# Altium project tclab_v1i1.PrjPcb (part 1 of 4)
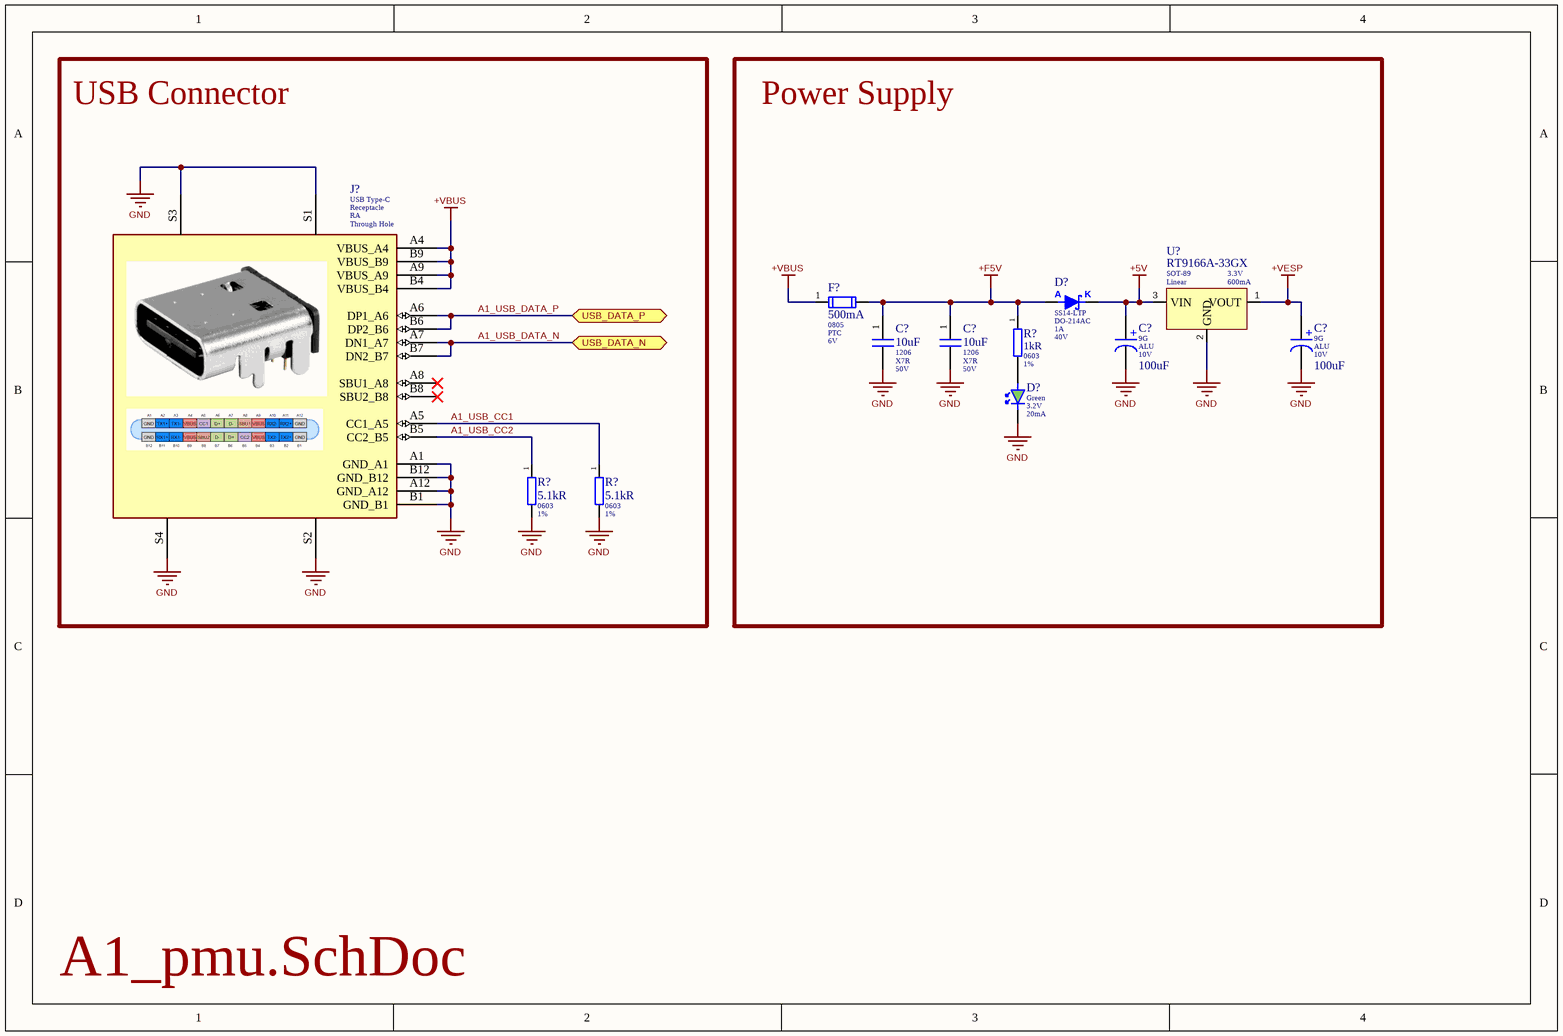
[diagram p0: A1_pmu.SchDoc]
6 sheets, 119 parts. Net scope: flat (ports and power ports of the same name join across sheets).
Sheets:
  A1_pmu.SchDoc
  A2_shield.SchDoc
  A3_plants.SchDoc
  A4_esp32.SchDoc
  A5_sub_interface.SchDoc
  A6_fan_indicator.SchDoc

## Sheet A1_pmu.SchDoc
size A4; SheetNumber: 1; SheetTotal: 6

### Parts
(Parts that share a designator on the sheet are numbered #1, #2 ... from top to bottom, then left to right.)
C?#1  Capacitance: 10uF  Case/Package: 1206  Dielectric: X7R  Voltage Rating (DC): 50V  [CAPC3216X18N]  (hidden comment: CAP-CER_10u_50V_10%_X7R_1206)
C?#2  Capacitance: 10uF  Case/Package: 1206  Dielectric: X7R  Voltage Rating (DC): 50V  [CAPC3216X18N]  (hidden comment: CAP-CER_10u_50V_10%_X7R_1206)
C?#3  _Case Size: 9G  _Type: ALU  Voltage Rating: 10V  Capacitance: 100uF  [CAPAE7866X56M]  (hidden comment: CAP-ALU_100uF_10V_20%_9G/SMD)
C?#4  _Case Size: 9G  _Type: ALU  Voltage Rating: 10V  Capacitance: 100uF  [CAPAE7866X56M]  (hidden comment: CAP-ALU_100uF_10V_20%_9G/SMD)
D?#1  MFG PN: SS14-LTP  Case/Package: DO-214AC  Average Rectified Current: 1A  Max Reverse Voltage (DC): 40V  [DIOM4327X30N]  (hidden comment: DIO-S_500mV_40V_1A_DO-214AC(SMA))
D?#2  Color: Green  Forward Voltage: 3.2V  Test Current: 20mA  [LEDC1608X08N_G]  (hidden comment: LED_green_3.2V_20mA_0603)
F?  Hold Current: 500mA  Case/Package: 0805  _Type: PTC  Voltage Rating: 6V  [FUSC2214X85N]  (hidden comment: FUSE-PTC_500mA_6V_0805_RST)
J?  _Type: USB Type-C  _Mating_type: Receptacle  _Orientation: RA  _Mount: Through Hole  [VALCON_CSP-USC16-TR]  (hidden comment: CON-USBC_receptacle_RA_TH)
R?#1  Resistance: 1kR  Case/Package: 0603  Tolerance: 1%  [RESC1608X06N]  (hidden comment: RES_1K_100mW_1%_0603)
R?#2  Resistance: 5.1kR  Case/Package: 0603  Tolerance: 1%  [RESC1608X06N]  (hidden comment: RES_5.1K_100mW_1%_0603)
R?#3  Resistance: 5.1kR  Case/Package: 0603  Tolerance: 1%  [RESC1608X06N]  (hidden comment: RES_5.1K_100mW_1%_0603)
U?#1  MFG PN: RT9166A-33GX  Case/Package: SOT-89  Type: Linear  Output Voltage: 3.3V  Output Current: 600mA  [SOT89-150P349X160-3N]  (hidden comment: REG-LIN_3-5.5Vin_3.3Vout_600mA_571mW_SOT-89)

### Blocks framed on the sheet
USB Connector: J? R?#2 R?#3
Power Supply: C?#1-C?#4 D?#1 D?#2 F? R?#1 U?#1

### Ports
USB_DATA_N (bidir), USB_DATA_P (bidir)

### Nets
+5V: C?#3.1(Positive) D?#1.2(K) U?#1.3(VIN)
+F5V: C?#1.1 C?#2.1 D?#1.1(A) F?.2 R?#1.1
+VBUS: F?.1 J?.A4(VBUS_A4) J?.A9(VBUS_A9) J?.B4(VBUS_B4) J?.B9(VBUS_B9)
+VESP: C?#4.1(Positive) U?#1.1(VOUT)
GND: C?#1.2 C?#2.2 C?#3.2(Negative) C?#4.2(Negative) D?#2.2(K) J?.A1(GND_A1) J?.A12(GND_A12) J?.B1(GND_B1) J?.B12(GND_B12) J?.S1(SHELL_GND_S1) J?.S2(SHELL_GND_S2) J?.S3(SHELL_GND_S3) J?.S4(SHELL_GND_S4) R?#2.2 R?#3.2 U?#1.2(GND)
A1_USB_CC1: J?.A5(CC1_A5) R?#3.1
A1_USB_CC2: J?.B5(CC2_B5) R?#2.1
A1_USB_DATA_N: J?.A7(DN1_A7) J?.B7(DN2_B7) ; port USB_DATA_N
A1_USB_DATA_P: J?.A6(DP1_A6) J?.B6(DP2_B6) ; port USB_DATA_P
NetD?#2_1: D?#2.1(A) R?#1.2

Not connected (* = marked no-connect by the designer): J? A8(SBU1_A8)* B8(SBU2_B8)*

### Notes on the sheet
- (in symbol Kemet_EDK107M010A9GAA) +

### Library data of the parts
C?#1 C?#2 = Samsung_CL31B106KBHNNNE: Tolerance: 10%; _Checked_PCB: HoP; Supplier 1: Mouser; MFG: Samsung; MFG PN: CL31B106KBHNNNE; RoHS: Yes; Category: Ceramic Capacitors; Stock 1: 1053279; Pricing 1: 1=0.33, 10=0.232, 50=0.232, 100=0.14, 1000=0.089, 10000=0.071 (USD); Mount: Surface Mount; Case Code (Metric): 3216; Case Code (Imperial): 1206; Min Operating Temperature: -55°C; Max Operating Temperature: 125°C; Packaging: Cut Tape; Series: CL; Lead Free: Lead Free; RoHS Compliant: Yes; ComponentLink1URL: http://www.samsungsem.com/kr/support/product-search/mlcc/CL31B106KBHNNNE.jsp?src-supplier=Digi-Key; ComponentLink1Description: http://www.samsungsem.com/kr/support/product-search/mlcc/CL31B106KBHNNNE.jsp?src-supplier=Digi-Key; Supplier Part Number 1: 187-CL31B106KBHNNNE; _Checked_SCH: HoP; _Creator: HoP; _SYM_REF: CAP-CER_10u_50V_10%_X7R_1206; Voltage Rating: 50V
C?#3 C?#4 = Kemet_EDK107M010A9GAA: MFG: KEMET; Tolerance: 20%; Ripple Current: 70mA; Life (Hours): 2000Hour; _Checked_PCB: HoP; Supplier 1: Mouser; MFG PN: EDK107M010A9GAA; RoHS: Yes; Category: Aluminum Electrolytic Capacitors; Stock 1: 3002; Pricing 1: 1=0.36, 10=0.248, 50=0.174, 100=0.149, 1000=0.094, 10000=0.089 (USD); Mount: Surface Mount; Case/Package: Radial; Min Operating Temperature: -40°C; Max Operating Temperature: 85°C; Ripple Current (AC): 70mA; Packaging: Cut Tape; Voltage Rating (DC): 10V; Series: EDK; Diameter: 6.3mm; Height: 5.4mm; Radiation Hardening: No; Reach SVHC Compliant: No; RoHS Compliant: Yes; ComponentLink1URL: https://datasheet.ciiva.com/8032/1680956-8032470.pdf?src-supplier=Element14; ComponentLink1Description: https://datasheet.ciiva.com/8032/1680956-8032470.pdf?src-supplier=Element14; Supplier Part Number 1: 80-EDK107M010A9GAA; _Checked_SCH: HoP; _Creator: HoP; _SYM_REF: CAP-ALU_100uF_10V_20%_9G/SMD
D?#1 = MCC_SS14-LTP: MFG: MCC; Forward Voltage: 500mV; Peak Non-Repetitive Surge Current: 30A; _Checked_PCB: HoP; Supplier 1: Mouser; RoHS: Yes; Category: Uncategorized; Stock 1: 415; Pricing 1: 1=0.26, 10=0.209, 50=0.209, 100=0.111, 1000=0.045, 10000=0.037 (USD); Mount: Surface Mount; Number of Pins: 2; Min Operating Temperature: -55°C; Max Operating Temperature: 150°C; Packaging: Tape and Reel; Series: -; RoHS Compliant: Yes; Lead Free: Lead Free; ComponentLink1URL: http://components.arrow.com/part/dataview/45990919S110376N2022?src-supplier=Arrow+Electronics; ComponentLink1Description: http://components.arrow.com/part/dataview/45990919S110376N2022?src-supplier=Arrow+Electronics; ComponentLink2URL: http://www.mccsemi.com/up_pdf/SS12-L-SS110-L(DO-214AC)-E.pdf?src-supplier=Digi-Key; ComponentLink2Description: http://www.mccsemi.com/up_pdf/SS12-L-SS110-L(DO-214AC)-E.pdf?src-supplier=Digi-Key; ComponentLink3URL: https://www.mccsemi.com/pdf/Products/SS12-L-SS110-L(DO-214AC)-E.pdf?src-supplier=Digi-Key; ComponentLink3Description: https://www.mccsemi.com/pdf/Products/SS12-L-SS110-L(DO-214AC)-E.pdf?src-supplier=Digi-Key; Supplier Part Number 1: 833-SS14-LTP; _Checked_SCH: HoP; _Creator: HoP; _SYM_REF: DIO-S_500mV_40V_1A_DO-214AC(SMA)
D?#2 = Wurth_150060GS75000: MFG: Wurth Elektronik; Dominant Wavelength: 525nm; Forward Current: 100mA; Lens Style: Clear, Rectangular; Luminous Intensity: 430mcd; Max Junction Temperature (Tj): 95°C; Max Reverse Voltage (DC): 5V; Output Current: 10µA; Peak Wavelength: 515nm; Power Dissipation: 105mW; Viewing Angle: 140°; _Checked_PCB: N.A; _Checked_SCH: HoP; Supplier: DigiKey; Supplier Part Number: 732-4971-1-ND; MFG PN: 150060GS75000; RoHS: Compliant; Category: LEDs; Stock: 374535; Pricing: 1=0.15, 50=0.142, 100=0.1239 (USD); Case/Package: 0603; Case Code (Imperial): 0603; Case Code (Metric): 1608; Height: 700µm; Lead Free: Lead Free; Length: 1.6mm; Max Operating Temperature: 85°C; Min Operating Temperature: -40°C; Mounting Technology: Surface Mount; Packaging: Tape and Reel; REACH SVHC: Unknown; Reverse Voltage: 5V; Wavelength: 525nm; Width: 800µm; ComponentLink1URL: https://datasheet.octopart.com:443/150060GS75000-W%C3%BCrth-Elektronik-datasheet-140603450.pdf?src-supplier=Wurth+Elektronik; ComponentLink1Description: https://datasheet.octopart.com:443/150060GS75000-W%C3%BCrth-Elektronik-datasheet-140603450.pdf?src-supplier=Wurth+Elektronik; ComponentLink2URL: https://datasheet.octopart.com:443/150060GS75000-W%C3%BCrth-Elektronik-datasheet-15976794.pdf?src-supplier=Upverter; ComponentLink2Description: https://datasheet.octopart.com:443/150060GS75000-W%C3%BCrth-Elektronik-datasheet-15976794.pdf?src-supplier=Upverter; ComponentLink3URL: https://datasheet.octopart.com:443/150060GS75000-W%C3%BCrth-Elektronik-datasheet-41196437.pdf?src-supplier=Future+Electronics; ComponentLink3Description: https://datasheet.octopart.com:443/150060GS75000-W%C3%BCrth-Elektronik-datasheet-41196437.pdf?src-supplier=Future+Electronics; _Creator: HoP; _SYM_REF: LED_green_3.2V_20mA_0603
F? = BOURNS_MF-PSMF050X-2: MFG: Bourns; Max Current Rating: 40A; Resistance: 900mR; Power Dissipation: 500mW; Trip Current: 1A; Time to Trip: 100ms; Approvals: UL; _Checked_PCB: HoP; Supplier 1: Mouser; MFG PN: MF-PSMF050X-2; RoHS: Yes; Category: PTC Resettable Fuses; Stock 1: 26346; Pricing 1: 1=0.33, 10=0.27, 50=0.27, 100=0.204, 1000=0.172, 10000=0.172 (USD); Mount: Surface Mount,PCB; Number of Pins: 2; Case Code (Metric): 2012; Case Code (Imperial): 0805; Terminal Material: Gold; Min Operating Temperature: -40°C; Max Operating Temperature: 85°C; Packaging: Tape and Reel; Operating Supply Voltage: 6V; Package Quantity: 3000; Current Rating: 40A; Termination: SMD/SMT; Max Power Dissipation: 500mW; Voltage Rating (DC): 6V; Series: MF-PSMF; Length: 2.3mm; Width: 1.5mm; Height: 0.85mm; Radiation Hardening: No; Reach SVHC Compliant: No; RoHS Compliant: Yes; ComponentLink1URL: https://datasheet.ciiva.com/3019/mfpsmf-3019799.pdf?src-supplier=Avnet; ComponentLink1Description: https://datasheet.ciiva.com/3019/mfpsmf-3019799.pdf?src-supplier=Avnet; ComponentLink2URL: https://datasheet.ciiva.com/326/mfpsmf-326489.pdf?src-supplier=Digi-Key; ComponentLink2Description: https://datasheet.ciiva.com/326/mfpsmf-326489.pdf?src-supplier=Digi-Key; ComponentLink3URL: https://datasheet.ciiva.com/326/mfpsmf-326490.pdf?src-supplier=Digi-Key; ComponentLink3Description: https://datasheet.ciiva.com/326/mfpsmf-326490.pdf?src-supplier=Digi-Key; ComponentLink4URL: https://datasheet.ciiva.com/326/mfpsmf-326488.pdf?src-supplier=Digi-Key; ComponentLink4Description: https://datasheet.ciiva.com/326/mfpsmf-326488.pdf?src-supplier=Digi-Key; ComponentLink5URL: https://datasheet.ciiva.com/32430/mf-psmf-series-eng-tds-32430651.pdf?src-supplier=Distrelec; ComponentLink5Description: https://datasheet.ciiva.com/32430/mf-psmf-series-eng-tds-32430651.pdf?src-supplier=Distrelec; ComponentLink6URL: https://datasheet.ciiva.com/1274/1442129-1274589.pdf?src-supplier=Element14; ComponentLink6Description: https://datasheet.ciiva.com/1274/1442129-1274589.pdf?src-supplier=Element14; ComponentLink7URL: https://datasheet.ciiva.com/22712/1442129-22712191.pdf?src-supplier=Element14; ComponentLink7Description: https://datasheet.ciiva.com/22712/1442129-22712191.pdf?src-supplier=Element14; ComponentLink8URL: https://datasheet.ciiva.com/22657/1442129-22657847.pdf?src-supplier=Element14; ComponentLink8Description: https://datasheet.ciiva.com/22657/1442129-22657847.pdf?src-supplier=Element14; ComponentLink9URL: https://datasheet.ciiva.com/4501/mfpsmf-69505-4501179.pdf?src-supplier=Mouser; ComponentLink9Description: https://datasheet.ciiva.com/4501/mfpsmf-69505-4501179.pdf?src-supplier=Mouser; Supplier Part Number 1: 652-MF-PSMF050X-2; _Checked_SCH: HoP; _Creator: HoP; _SYM_REF: FUSE-PTC_500mA_6V_0805_RST
J? = Valcon_CSP-USC16-TR: MFG: Valcon; _Checked_PCB: HoP; Package: None; Price: None; Value: *; Purchase-URL: https://pricing.snapeda.com/search/part/CSP-USC16-TR/?ref=eda; SnapEDA_Link: https://www.snapeda.com/parts/CSP-USC16-TR/Valcon/view-part/?ref=snap; Check_prices: https://www.snapeda.com/parts/CSP-USC16-TR/Valcon/view-part/?ref=eda; Availability: In Stock; _Checked_SCH: HoP; _Creator: HoP; MFG PN: CSP-USC16-TR; _SYM_REF: CON-USBC_receptacle_RA_TH
R?#1 = Yageo_RC0603FR-071KL: MFG: Yageo; Temperature Coefficient: 100ppm/°C; Power Rating: 100mW; Voltage Rating: 50V; _Checked_PCB: HoP; _Value: 1000; Supplier 1: Mouser; MFG PN: RC0603FR-071KL; RoHS: Yes; Category: Chip SMD Resistors; Stock 1: 9806849; Pricing 1: 1=0.1, 10=0.019, 50=0.019, 100=0.007, 1000=0.004, 10000=0.002 (USD); Contact Plating: Tin,Matte; Case Code (Imperial): 0603; Case Code (Metric): 1608; Size Code: 0603; Min Operating Temperature: -55°C; Max Operating Temperature: 155°C; Resistor Type: Thick Film; Packaging: Tape and Reel; Termination: SMD/SMT; Features: Moisture Resistant; Series: RC; Max Power Dissipation: 100mW; Number of Terminations: 2; Technology: THICK FILM; Resistance Tolerance: 1%; Construction: Rectangular; Length: 1.6mm; Height: 0.45mm; Depth: 0.8mm; Reach SVHC Compliant: No; Lead Free: Lead Free; Military Standard: Not; RoHS Compliant: Yes; Supplier Part Number 1: 603-RC0603FR-071KL; _Checked_SCH: HoP; _Creator: HoP; _SYM_REF: RES_1K_100mW_1%_0603
R?#2 R?#3 = Yageo_RC0603FR-075K1L: MFG: Yageo; Power Rating: 100mW; Temperature Coefficient: 100ppm/°C; Voltage Rating: 50V; _Checked_PCB: HoP; _Value: 5100; Supplier 1: Mouser; MFG PN: RC0603FR-075K1L; RoHS: Yes; Category: Chip SMD Resistors; Stock 1: 136224; Pricing 1: 1=0.1, 10=0.016, 50=0.016, 100=0.008, 1000=0.004, 10000=0.002 (USD); Number of Pins: 2; Case Code (Imperial): 0603; Case Code (Metric): 1608; Size Code: 0603; Min Operating Temperature: -55°C; Max Operating Temperature: 155°C; Series: RC; Packaging: Tape and Reel; Package Quantity: 1; Termination: SMD/SMT; Resistor Type: Thick Film; Number of Terminations: 2; Max Power Dissipation: 100mW; Voltage Rating (DC): 50V; Features: Moisture Resistant; Resistance Tolerance: 1%; Construction: Rectangular; Length: 0.063inch; Width: 0.031inch; Height: 0.022inch; Depth: 0.8mm; RoHS Compliant: Yes; Reach SVHC Compliant: No; Military Standard: Not; Lead Free: Lead Free; ComponentLink1URL: https://datasheet.ciiva.com/46395/443971-46395016.pdf?src-supplier=Element14; ComponentLink1Description: https://datasheet.ciiva.com/46395/443971-46395016.pdf?src-supplier=Element14; ComponentLink2URL: https://datasheet.ciiva.com/2454/pyu-r-int-thick-7-2454046.pdf?src-supplier=Digi-Key; ComponentLink2Description: https://datasheet.ciiva.com/2454/pyu-r-int-thick-7-2454046.pdf?src-supplier=Digi-Key; ComponentLink3URL: https://datasheet.ciiva.com/2454/pyu-r-int-thick-7-2454047.pdf?src-supplier=Digi-Key; ComponentLink3Description: https://datasheet.ciiva.com/2454/pyu-r-int-thick-7-2454047.pdf?src-supplier=Digi-Key; ComponentLink4URL: https://datasheet.ciiva.com/2454/pyu-r-int-thick-7-2454045.pdf?src-supplier=Digi-Key; ComponentLink4Description: https://datasheet.ciiva.com/2454/pyu-r-int-thick-7-2454045.pdf?src-supplier=Digi-Key; ComponentLink5URL: https://datasheet.ciiva.com/15189/getdatasheetpartid-326732-15189786.pdf?src-supplier=Verical; ComponentLink5Description: https://datasheet.ciiva.com/15189/getdatasheetpartid-326732-15189786.pdf?src-supplier=Verical; Supplier Part Number 1: 603-RC0603FR-075K1L; _Checked_SCH: HoP; _Creator: HoP; _SYM_REF: RES_5.1K_100mW_1%_0603
U?#1 = Richtek_RT9166A-33GX: _Checked_PCB: N.A; _Checked_SCH: HoP; Max Supply Voltage: 5.5V; _Creator: HoP; _Package: SOT-89; _SYM_REF: REG-LIN_3-5.5Vin_3.3Vout_600mA_571mW_SOT-89; MFG: Richtek

## Sheet A2_shield.SchDoc
size A4; SheetNumber: 2; SheetTotal: 6
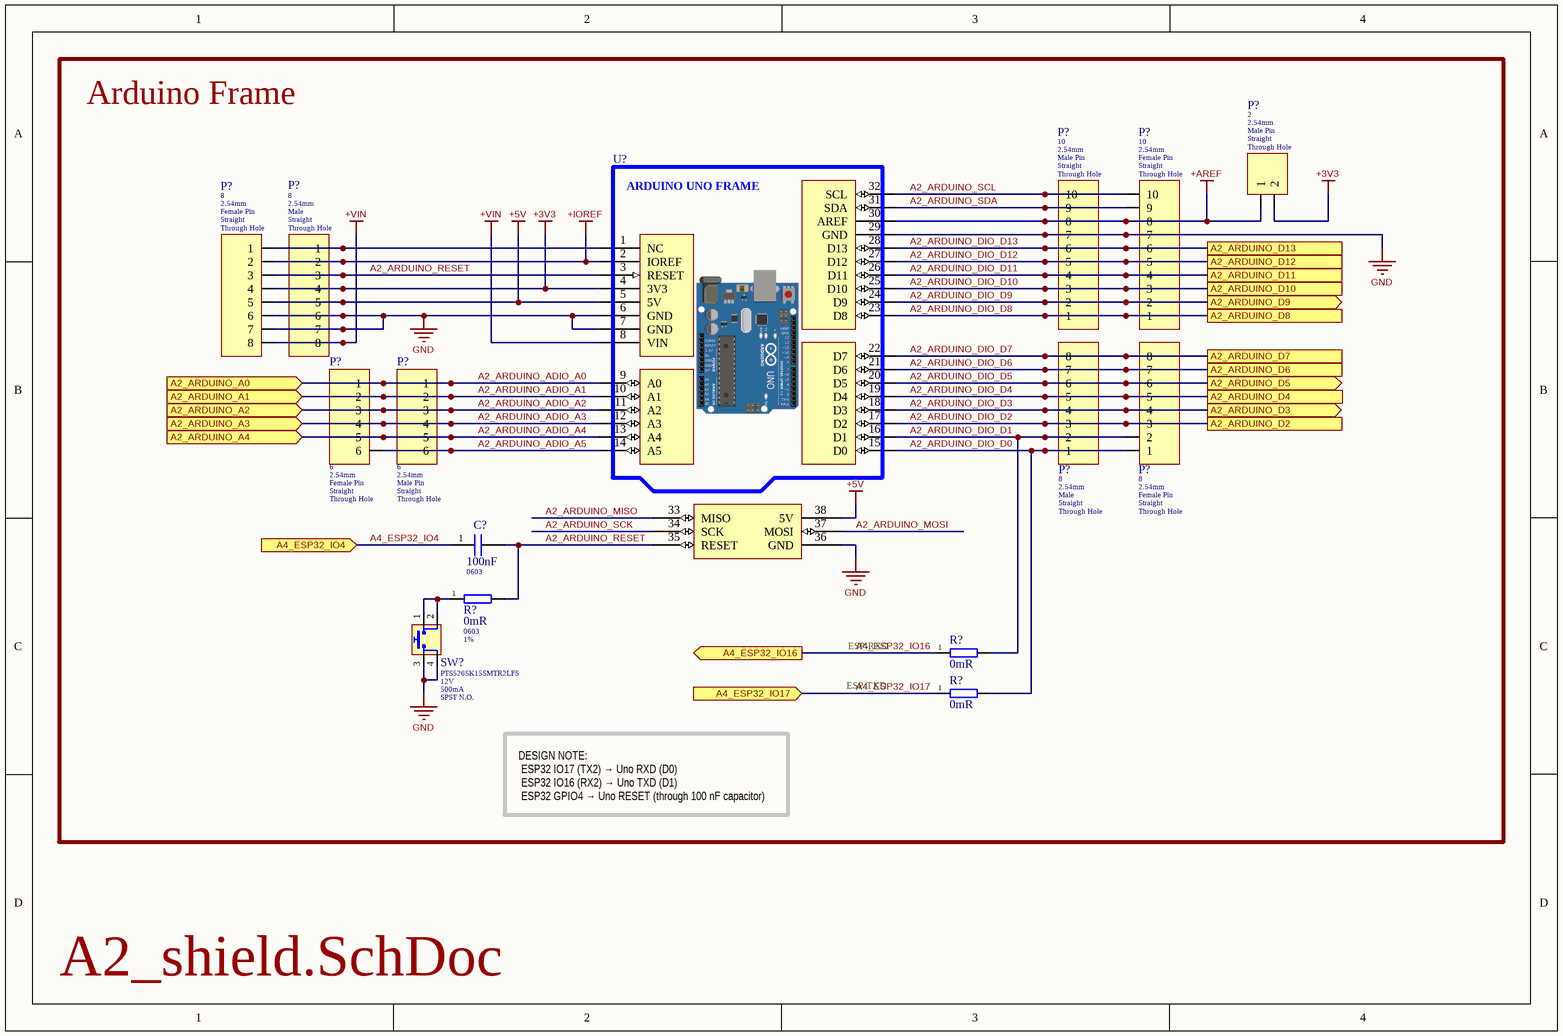
[diagram p1: A2_shield.SchDoc]

### Parts
(Parts that share a designator on the sheet are numbered #1, #2 ... from top to bottom, then left to right.)
C?#5  Capacitance: 100nF  Case/Package: 0603  [CAPC1608X09N]  (hidden comment: CAP-CER_100n_50V_20%_X7R_0603)
P?#1  Number of Contacts: 2  Pitch: 2.54mm  Contact Type: Male Pin  Orientation: Straight  Mounting Technology: Through Hole  [HARWIN_M20-9730246]  (hidden comment: CON-BS_male_2X1_254_ST_TH)
P?#2  Number of Contacts: 8  Pitch: 2.54mm  Contact Gender: Female Pin  Orientation: Straight  Mounting Technology: Through Hole  [HARWIN_M20-7820842]  (hidden comment: CON-BS_female_8X1_254_ST_TH)
P?#3  Number of Contacts: 8  Pitch: 2.54mm  Contact Gender: Male  Orientation: Straight  Mounting Technology: Through Hole  [HARWIN_M20-9730845]  (hidden comment: CON-BS_male_8X1_254_ST_TH)
P?#4  Number of Contacts: 10  Pitch: 2.54mm  Connector Type: Male Pin  Orientation: Straight  Mounting Technology: Through Hole  [HARWIN_M20-9731045]  (hidden comment: CON-BS_male_10X1_254_ST_TH)
P?#5  Number of Contacts: 10  Pitch: 2.54mm  Contact Gender: Female Pin  Orientation: Straight  Mounting Technology: Through Hole  [HARWIN_M20-7821046]  (hidden comment: CON-BS_female_10X1_254_ST_TH)
P?#6  Number of Contacts: 6  Pitch: 2.54mm  Contact Gender: Female Pin  Orientation: Straight  Mounting Technology: Through Hole  [HARWIN_M20-7820646]  (hidden comment: CON-BS_female_6X1_254_ST_TH)
P?#7  Number of Contacts: 6  Pitch: 2.54mm  Connector Type: Male Pin  Orientation: Straight  Mounting Technology: Through Hole  [HARWIN_M20-9730645]  (hidden comment: CON-BS_male_6X1_254_ST_TH)
P?#8  Number of Contacts: 8  Pitch: 2.54mm  Contact Gender: Male  Orientation: Straight  Mounting Technology: Through Hole  [HARWIN_M20-9730845]  (hidden comment: CON-BS_male_8X1_254_ST_TH)
P?#9  Number of Contacts: 8  Pitch: 2.54mm  Contact Gender: Female Pin  Orientation: Straight  Mounting Technology: Through Hole  [HARWIN_M20-7820842]  (hidden comment: CON-BS_female_8X1_254_ST_TH)
R?#4  Resistance: 0mR  Case/Package: 0603  Tolerance: 1%  [RESC1608X06N]  (hidden comment: RES_0R_100mW_1%_0603)
R?#5  Resistance: 0mR  [RESC1608X06N]  (hidden comment: RES_0R_100mW_1%_0603)
R?#6  Resistance: 0mR  [RESC1608X06N]  (hidden comment: RES_0R_100mW_1%_0603)
SW?#1  MFG PN: PTS526SK15SMTR2LFS  _Maximum Voltage: 12V  _Maximum Current: 500mA  _Function: SPST N.O.  [CK_PTS526SK15SMTR2LFS]  (hidden comment: SW_Tactile_1_SPST-N.O._12_500m_SMD)
U?#2  ARDUINO_UNO-FRAME-01  [ARDUINO_UNO_FRAME]  (value not drawn)  (no BOM)

### Ports
A2_ARDUINO_A0 (in), A2_ARDUINO_A1 (in), A2_ARDUINO_A2 (in), A2_ARDUINO_A3 (in), A2_ARDUINO_A4 (in), A2_ARDUINO_D2, A2_ARDUINO_D3 (out), A2_ARDUINO_D4, A2_ARDUINO_D5 (out), A2_ARDUINO_D6, A2_ARDUINO_D7, A2_ARDUINO_D8, A2_ARDUINO_D9 (out), A2_ARDUINO_D10, A2_ARDUINO_D11, A2_ARDUINO_D12, A2_ARDUINO_D13, A4_ESP32_IO4 (in), A4_ESP32_IO16 (out), A4_ESP32_IO17 (in)

### Nets
+3V3: P?#1.2 P?#2.4 P?#3.4 U?#2.4(3V3)
+5V: P?#2.5 P?#3.5 U?#2.5(5V) U?#2.38(5V)
+AREF: P?#1.1 P?#4.8 P?#5.8 U?#2.30(AREF)
+IOREF: P?#2.2 P?#3.2 U?#2.2(IOREF)
+VIN: P?#2.8 P?#3.8 U?#2.8(VIN)
GND: P?#2.6 P?#2.7 P?#3.6 P?#3.7 P?#4.7 P?#5.7 SW?#1.3 SW?#1.4 U?#2.6(GND) U?#2.7(GND) U?#2.29(GND) U?#2.36(GND)
A2_ARDUINO_ADIO_A0: P?#6.1 P?#7.1 U?#2.9(A0) ; port A2_ARDUINO_A0
A2_ARDUINO_ADIO_A1: P?#6.2 P?#7.2 U?#2.10(A1) ; port A2_ARDUINO_A1
A2_ARDUINO_ADIO_A2: P?#6.3 P?#7.3 U?#2.11(A2) ; port A2_ARDUINO_A2
A2_ARDUINO_ADIO_A3: P?#6.4 P?#7.4 U?#2.12(A3) ; port A2_ARDUINO_A3
A2_ARDUINO_ADIO_A4: P?#6.5 P?#7.5 U?#2.13(A4) ; port A2_ARDUINO_A4
A2_ARDUINO_ADIO_A5: P?#6.6 P?#7.6 U?#2.14(A5)
A2_ARDUINO_DIO_D0: P?#8.1 P?#9.1 R?#6.2 U?#2.15(D0)
A2_ARDUINO_DIO_D1: P?#8.2 P?#9.2 R?#5.2 U?#2.16(D1)
A2_ARDUINO_DIO_D2: P?#8.3 P?#9.3 U?#2.17(D2) ; port A2_ARDUINO_D2
A2_ARDUINO_DIO_D3: P?#8.4 P?#9.4 U?#2.18(D3) ; port A2_ARDUINO_D3
A2_ARDUINO_DIO_D4: P?#8.5 P?#9.5 U?#2.19(D4) ; port A2_ARDUINO_D4
A2_ARDUINO_DIO_D5: P?#8.6 P?#9.6 U?#2.20(D5) ; port A2_ARDUINO_D5
A2_ARDUINO_DIO_D6: P?#8.7 P?#9.7 U?#2.21(D6) ; port A2_ARDUINO_D6
A2_ARDUINO_DIO_D7: P?#8.8 P?#9.8 U?#2.22(D7) ; port A2_ARDUINO_D7
A2_ARDUINO_DIO_D8: P?#4.1 P?#5.1 U?#2.23(D8) ; port A2_ARDUINO_D8
A2_ARDUINO_DIO_D9: P?#4.2 P?#5.2 U?#2.24(D9) ; port A2_ARDUINO_D9
A2_ARDUINO_DIO_D10: P?#4.3 P?#5.3 U?#2.25(D10) ; port A2_ARDUINO_D10
A2_ARDUINO_DIO_D11: P?#4.4 P?#5.4 U?#2.26(D11) ; port A2_ARDUINO_D11
A2_ARDUINO_DIO_D12: P?#4.5 P?#5.5 U?#2.27(D12) ; port A2_ARDUINO_D12
A2_ARDUINO_DIO_D13: P?#4.6 P?#5.6 U?#2.28(D13) ; port A2_ARDUINO_D13
A2_ARDUINO_MISO: U?#2.33(MISO)
A2_ARDUINO_MOSI: U?#2.37(MOSI)
A2_ARDUINO_RESET: C?#5.2 P?#2.3 P?#3.3 R?#4.2 U?#2.3(RESET) U?#2.35(RESET)
A2_ARDUINO_SCK: U?#2.34(SCK)
A2_ARDUINO_SCL: P?#4.10 P?#5.10 U?#2.32(SCL)
A2_ARDUINO_SDA: P?#4.9 P?#5.9 U?#2.31(SDA)
A4_ESP32_IO4: C?#5.1 ; port A4_ESP32_IO4
A4_ESP32_IO16: R?#5.1 ; port A4_ESP32_IO16
A4_ESP32_IO17: R?#6.1 ; port A4_ESP32_IO17
NetP?#2_1: P?#2.1 P?#3.1 U?#2.1(NC)
NetR?#4_1: R?#4.1 SW?#1.1 SW?#1.2

### Notes on the sheet
- Arduino Frame
- ESP-RXD
- ESP-TXD
- DESIGN NOTE:
  ESP32 IO17 (TX2) → Uno RXD (D0)
  ESP32 IO16 (RX2) → Uno TXD (D1)
  ESP32 GPIO4 → Uno RESET (through 100 nF capacitor)
- (in symbol Arduino_Uno-Frame-01) ARDUINO UNO FRAME

### Library data of the parts
C?#5 = Kemet_C0603C104M5RAC: MFG: KEMET; Dielectric Material: Ceramic; Tolerance: 20%; _Checked_PCB: HoP; Dielectric: X7R; Voltage Rating (DC): 50V; Supplier 1: Mouser; MFG PN: C0603C104M5RAC; RoHS: Yes; Category: Ceramic Capacitors; Stock 1: 461921; Pricing 1: 1=0.1, 10=0.033, 50=0.033, 100=0.015, 1000=0.009, 10000=0.006 (USD); Mount: Surface Mount; Case Code (Imperial): 0603; Case Code (Metric): 1608; Min Operating Temperature: -55°C; Max Operating Temperature: 125°C; Packaging: Tape and Reel; Package Quantity: 4000; Termination: SMD/SMT; Series: C0603C; Construction: Flat; Length: 1.6mm; Width: 0.8mm; RoHS Compliant: Yes; ComponentLink1URL: http://www.mouser.com/ds/2/212/KEM_C1002_X7R_SMD-1102033.pdf?src-supplier=Mouser; ComponentLink1Description: http://www.mouser.com/ds/2/212/KEM_C1002_X7R_SMD-1102033.pdf?src-supplier=Mouser; Supplier Part Number 1: 80-C0603C104M5RAC; _Checked_SCH: HoP; _Creator: HoP; _SYM_REF: CAP-CER_100n_50V_20%_X7R_0603
P?#1 = Harwin_M20-9730246: MFG: Harwin; Current Rating: 3A; Voltage Rating: 750V; Contact Resistance: 30mR; Mated Stacking Heights: 16.54mm; _Checked_PCB: N.A; _Checked_SCH: HoP; Supplier: Mouser; Supplier Part Number: 855-M20-9730246; MFG PN: M20-9730246; RoHS: Yes; Category: Headers and Wire Housings; Stock: 7153; Pricing: 1=0.1, 10=0.08, 50=0.08, 100=0.066, 1000=0.053, 10000=0.043 (USD); Case/Package: SIL; Contact Material: Brass; Contact Plating: Tin; Color: Black; Housing Color: Black; Housing Material: Nylon; Contact Shape: Square; Contact Finish - Mating: TIN; Insulation Material: Nylon; Insulation Color: Black; Min Operating Temperature: -40°C; Max Operating Temperature: 105°C; Number of Rows: 1; Max Current Rating: 3A; Number of Positions: 2; Termination: Solder; Package Quantity: 1000; Packaging: Bulk; Series: M20; Fastening Type: Pull; Length: 5.08mm; Depth: 2.54mm; Contact Mating Length: 0.276inch; Radiation Hardening: No; RoHS Compliant: Yes; Flammability Rating: UL94 V-0; ComponentLink1URL: https://datasheet.ciiva.com/26899/getdatasheetpartid-501522-26899400.pdf?src-supplier=Verical; ComponentLink1Description: https://datasheet.ciiva.com/26899/getdatasheetpartid-501522-26899400.pdf?src-supplier=Verical; _Creator: HoP; _SYM_REF: CON-BS_male_2X1_254_ST_TH
P?#2 P?#9 = Harwin_M20-7820842: MFG: Harwin; Connector Type: Receptacle, Socket; Contact Resistance: 20mΩ; Current Rating: 3A; Dielectric Material: Polyamide; Gender: Female; Insulation Resistance: 1GΩ; _Checked_PCB: N.A; _Creator: HoP; Supplier: DigiKey; Supplier Part Number: 952-1823-ND; MFG PN: M20-7820842; RoHS: Compliant; Category: Card Edge Connectors; Stock: 504; Pricing: 1=1.27, 27=1.0063, 108=0.91231, 513=0.81725, 1026=0.77824, 5022=0.69577, 10017=0.66272 (USD); Case/Package: SIL; Color: Black; Contact Material: Bronze; Depth: 2.5mm; Housing Color: Black; Housing Material: Polyamide; Length: 20.72mm; Lifecycle Status: Production; Max Current Rating: 3A; Max Operating Temperature: 105°C; Min Operating Temperature: -40°C; Pins: 8; Number of Positions: 8; Number of Rows: 1; Radiation Hardening: No; REACH SVHC: Yes; Terminal Pitch: 2.54mm; Termination: Solder; Weight: 719.992839mg; ComponentLink1URL: https://datasheet.octopart.com:443/M20-7820842-Harwin-datasheet-176383844.pdf?src-supplier=Newark; ComponentLink1Description: https://datasheet.octopart.com:443/M20-7820842-Harwin-datasheet-176383844.pdf?src-supplier=Newark; ComponentLink2URL: https://datasheet.octopart.com:443/M20-7820842-Harwin-datasheet-99119574.pdf?src-supplier=Master+Electronics; ComponentLink2Description: https://datasheet.octopart.com:443/M20-7820842-Harwin-datasheet-99119574.pdf?src-supplier=Master+Electronics; ComponentLink3URL: http://sigma.octopart.com:80/15888290/rohs_statement/Harwin-M20-7820842.pdf?src-supplier=Compliance+Statements; ComponentLink3Description: http://sigma.octopart.com:80/15888290/rohs_statement/Harwin-M20-7820842.pdf?src-supplier=Compliance+Statements; _Checked_SCH: N.A; _SYM_REF: CON-BS_female_8X1_254_ST_TH; Contact Plating: Gold, Tin
P?#3 P?#8 = Harwin_M20-9730845: MFG: Harwin; Connector Type: Male Pin; Contact Resistance: 25mΩ; Current Rating: 3A; Dielectric Material: Polyamide; Insulation Resistance: 1GΩ; Voltage Rating: 750V; _Checked_PCB: N.A; _Checked_SCH: HoP; Supplier: DigiKey; Supplier Part Number: 952-1999-ND; MFG PN: M20-9730845; RoHS: Compliant; Category: Card Edge Connectors; Stock: 3821; Pricing: 1=0.43, 10=0.365, 100=0.3103, 500=0.2769, 1000=0.26367, 5000=0.23535, 10000=0.22412 (USD); Case/Package: SIL; Color: Black; Contact Material: Brass; Contact Mating Length: 7.0104mm; Contact Plating: Gold; Depth: 2.54mm; Gender: Male; Housing Color: Black; Housing Material: Nylon; Length: 20.32mm; Lifecycle Status: Production; Max Current Rating: 3A; Max Operating Temperature: 105°C; Min Operating Temperature: -40°C; Pins: 8; Number of Positions: 8; Number of Rows: 1; Radiation Hardening: No; REACH SVHC: Yes; Terminal Pitch: 2.54mm; Termination: Solder; ComponentLink1URL: https://datasheet.octopart.com:443/M20-9730845-Harwin-datasheet-179990786.pdf?src-supplier=IHS; ComponentLink1Description: https://datasheet.octopart.com:443/M20-9730845-Harwin-datasheet-179990786.pdf?src-supplier=IHS; _Creator: HoP; _SYM_REF: CON-BS_male_8X1_254_ST_TH
P?#4 = Harwin_M20-9731045: MFG: Harwin; Contact Resistance: 25mΩ; Current Rating: 3A; Dielectric Material: Polyamide; Gender: Male; Insulation Resistance: 1GΩ; Voltage Rating: 750V; _Checked_PCB: N.A; _Checked_SCH: HoP; Supplier: DigiKey; Supplier Part Number: 952-1841-ND; MFG PN: M20-9731045; RoHS: Compliant; Category: Card Edge Connectors; Stock: 614; Pricing: 1=0.54, 10=0.455, 100=0.387, 500=0.34534, 1000=0.32885, 5000=0.29354, 10000=0.27953 (USD); Case/Package: SIL; Color: Black; Contact Gender: Male; Contact Material: Brass; Contact Mating Length: 7.0104mm; Contact Plating: Gold; Depth: 2.54mm; Housing Color: Black; Housing Material: Nylon; Length: 25.4mm; Lifecycle Status: Production; Max Current Rating: 3A; Max Operating Temperature: 105°C; Min Operating Temperature: -40°C; Pins: 10; Number of Positions: 10; Number of Rows: 1; Radiation Hardening: No; REACH SVHC: Yes; Terminal Pitch: 2.54mm; Termination: Solder; ComponentLink1URL: https://datasheet.octopart.com:443/M20-9731045-Harwin-datasheet-179990786.pdf?src-supplier=IHS; ComponentLink1Description: https://datasheet.octopart.com:443/M20-9731045-Harwin-datasheet-179990786.pdf?src-supplier=IHS; _Creator: HoP; _SYM_REF: CON-BS_male_10X1_254_ST_TH
P?#5 = Harwin_M20-7821046: MFG: Harwin; Connector Type: Receptacle, Socket; Contact Resistance: 20mΩ; Current Rating: 3A; Dielectric Material: Polyamide; Gender: Female; Hole Diameter: 800µm; Insulation Resistance: 1GΩ; Operating Force: 4.8928N; _Checked_PCB: N.A; _Checked_SCH: HoP; Supplier: DigiKey; Supplier Part Number: 952-1847-ND; MFG PN: M20-7821046; RoHS: Compliant; Category: Card Edge Connectors; Stock: 1359; Pricing: 1=1.37, 22=1.10409, 110=0.98555, 506=0.88482, 1012=0.84258, 5016=0.75263, 10010=0.71686 (USD); Case/Package: SIL; Color: Black; Contact Material: Bronze; Contact Plating: Tin; Depth: 2.5mm; Housing Color: Black; Housing Material: Polyamide; Lead Pitch: 2.54mm; Length: 25.8mm; Lifecycle Status: Production; Max Current Rating: 3A; Max Operating Temperature: 105°C; Min Operating Temperature: -40°C; Pins: 10; Number of Positions: 10; Number of Rows: 1; Radiation Hardening: No; REACH SVHC: Yes; Terminal Pitch: 2.54mm; Termination: Solder; ComponentLink1URL: https://datasheet.octopart.com:443/M20-7821046-Harwin-datasheet-176383844.pdf?src-supplier=Electro+Sonic; ComponentLink1Description: https://datasheet.octopart.com:443/M20-7821046-Harwin-datasheet-176383844.pdf?src-supplier=Electro+Sonic; ComponentLink2URL: https://datasheet.octopart.com:443/M20-7821046-Harwin-datasheet-99119574.pdf?src-supplier=Upverter; ComponentLink2Description: https://datasheet.octopart.com:443/M20-7821046-Harwin-datasheet-99119574.pdf?src-supplier=Upverter; ComponentLink3URL: https://datasheet.octopart.com:443/M20-7821046-Harwin-datasheet-526273.pdf?src-supplier=Upverter; ComponentLink3Description: https://datasheet.octopart.com:443/M20-7821046-Harwin-datasheet-526273.pdf?src-supplier=Upverter; ComponentLink4URL: https://datasheet.octopart.com:443/M20-7821046-Harwin-datasheet-96624206.pdf?src-supplier=element14+APAC; ComponentLink4Description: https://datasheet.octopart.com:443/M20-7821046-Harwin-datasheet-96624206.pdf?src-supplier=element14+APAC; ComponentLink5URL: https://datasheet.octopart.com:443/M20-7821046-Harwin-datasheet-6396485.pdf?src-supplier=Newark; ComponentLink5Description: https://datasheet.octopart.com:443/M20-7821046-Harwin-datasheet-6396485.pdf?src-supplier=Newark; ComponentLink6URL: https://datasheet.octopart.com:443/M20-7821046-Harwin-datasheet-32864534.pdf?src-supplier=Newark; ComponentLink6Description: https://datasheet.octopart.com:443/M20-7821046-Harwin-datasheet-32864534.pdf?src-supplier=Newark; ComponentLink7URL: https://datasheet.octopart.com:443/M20-7821046-Harwin-datasheet-15888280.pdf?src-supplier=Newark; ComponentLink7Description: https://datasheet.octopart.com:443/M20-7821046-Harwin-datasheet-15888280.pdf?src-supplier=Newark; ComponentLink8URL: https://datasheet.octopart.com:443/M20-7821046-Harwin-datasheet-188872139.pdf?src-supplier=TME; ComponentLink8Description: https://datasheet.octopart.com:443/M20-7821046-Harwin-datasheet-188872139.pdf?src-supplier=TME; ComponentLink9URL: https://datasheet.octopart.com:443/M20-7821046-Harwin-datasheet-14706651.pdf?src-supplier=Farnell; ComponentLink9Description: https://datasheet.octopart.com:443/M20-7821046-Harwin-datasheet-14706651.pdf?src-supplier=Farnell; ComponentLink10URL: http://sigma.octopart.com:80/15888295/rohs_statement/Harwin-M20-7821046.pdf?src-supplier=Compliance+Statements; ComponentLink10Description: http://sigma.octopart.com:80/15888295/rohs_statement/Harwin-M20-7821046.pdf?src-supplier=Compliance+Statements; _Creator: HoP; _SYM_REF: CON-BS_female_10X1_254_ST_TH
P?#6 = Harwin_M20-7820646: MFG: Harwin; Connector Type: Receptacle, Socket; Contact Resistance: 20mΩ; Current Rating: 3A; Dielectric Material: Polyamide; Gender: Female; Insulation Resistance: 1GΩ; _Checked_PCB: N.A; _Checked_SCH: HoP; Supplier: DigiKey; Supplier Part Number: 952-1809-ND; MFG PN: M20-7820646; RoHS: Compliant; Category: Card Edge Connectors; Stock: 1442; Pricing: 1=1.11, 36=0.86417, 108=0.79954, 504=0.7171, 1008=0.68287, 5004=0.60989, 10008=0.58081 (USD); Case/Package: SIL; Color: Black; Contact Material: Bronze; Contact Plating: Tin; Depth: 2.5mm; Housing Color: Black; Housing Material: Nylon; Length: 15.64mm; Lifecycle Status: Production; Max Current Rating: 3A; Max Operating Temperature: 105°C; Min Operating Temperature: -40°C; Pins: 6; Number of Positions: 6; Number of Rows: 1; Radiation Hardening: No; REACH SVHC: Yes; Terminal Pitch: 2.54mm; Termination: Solder; ComponentLink1URL: https://datasheet.octopart.com:443/M20-7820646-Harwin-datasheet-176383844.pdf?src-supplier=Newark; ComponentLink1Description: https://datasheet.octopart.com:443/M20-7820646-Harwin-datasheet-176383844.pdf?src-supplier=Newark; ComponentLink2URL: https://datasheet.octopart.com:443/M20-7820646-Harwin-datasheet-99119574.pdf?src-supplier=Farnell; ComponentLink2Description: https://datasheet.octopart.com:443/M20-7820646-Harwin-datasheet-99119574.pdf?src-supplier=Farnell; ComponentLink3URL: https://datasheet.octopart.com:443/M20-7820646-Harwin-datasheet-188872139.pdf?src-supplier=TME; ComponentLink3Description: https://datasheet.octopart.com:443/M20-7820646-Harwin-datasheet-188872139.pdf?src-supplier=TME; ComponentLink4URL: https://datasheet.octopart.com:443/M20-7820646-Harwin-datasheet-137074310.pdf?src-supplier=X-ON; ComponentLink4Description: https://datasheet.octopart.com:443/M20-7820646-Harwin-datasheet-137074310.pdf?src-supplier=X-ON; ComponentLink5URL: http://sigma.octopart.com:80/15888285/rohs_statement/Harwin-M20-7820646.pdf?src-supplier=Compliance+Statements; ComponentLink5Description: http://sigma.octopart.com:80/15888285/rohs_statement/Harwin-M20-7820646.pdf?src-supplier=Compliance+Statements; _Creator: HoP; _SYM_REF: CON-BS_female_6X1_254_ST_TH
P?#7 = Harwin_M20-9730645: MFG: Harwin; Contact Resistance: 25mΩ; Current Rating: 3A; Dielectric Material: Polyamide; Insulation Resistance: 1GΩ; Voltage Rating: 750V; _Checked_PCB: N.A; _Checked_SCH: HoP; Supplier: DigiKey; Supplier Part Number: 952-1984-ND; MFG PN: M20-9730645; RoHS: Compliant; Category: Headers and Wire Housings; Stock: 2418; Pricing: 1=0.33, 10=0.282, 100=0.2395, 500=0.21372, 1000=0.20351, 5000=0.18165, 10000=0.17298 (USD); Case/Package: SIL; Color: Black; Contact Gender: Male; Contact Material: Brass; Contact Mating Length: 7.0104mm; Contact Plating: Gold; Depth: 2.54mm; Housing Color: Black; Housing Material: Nylon; Length: 15.24mm; Lifecycle Status: Production; Max Current Rating: 3A; Max Operating Temperature: 105°C; Min Operating Temperature: -40°C; Pins: 6; Number of Positions: 6; Number of Rows: 1; Packaging: Bulk; Radiation Hardening: No; REACH SVHC: Yes; Terminal Pitch: 2.54mm; Termination: Solder; ComponentLink1URL: https://datasheet.octopart.com:443/M20-9730645-Harwin-datasheet-179990786.pdf?src-supplier=IHS; ComponentLink1Description: https://datasheet.octopart.com:443/M20-9730645-Harwin-datasheet-179990786.pdf?src-supplier=IHS; _Creator: HoP; _SYM_REF: CON-BS_male_6X1_254_ST_TH
R?#4 = Yageo_RC0603FR-070RL: MFG: Yageo; Power Rating: 100mW; Voltage Rating (DC): 50V; Temperature Coefficient: 200ppm/°C; _Checked_PCB: HoP; _Value: 0; Supplier 1: Mouser; MFG PN: RC0603FR-070RL; RoHS: Yes; Category: Chip SMD Resistors; Stock 1: 3348927; Pricing 1: 1=0.1, 10=0.01, 50=0.01, 100=0.005, 1000=0.004, 10000=0.003 (USD); Number of Pins: 2; Contact Plating: Tin,Matte; Case Code (Metric): 1608; Case Code (Imperial): 0603; Min Operating Temperature: -55°C; Max Operating Temperature: 155°C; Packaging: Tape and Reel; Resistor Type: Thick Film; Package Quantity: 5000; Voltage Rating: 50V; Number of Terminations: 2; Termination: SMD/SMT; Max Power Dissipation: 100mW; Features: Moisture Resistant; Series: RC; Construction: Rectangular; Resistance Tolerance: 1%; Technology: THICK FILM; Length: 1.6mm; Width: 0.8mm; Height: 0.45mm; Depth: 0.8mm; Reach SVHC Compliant: No; Lead Free: Lead Free; RoHS Compliant: Yes; Military Standard: Not; ComponentLink1URL: https://datasheet.ciiva.com/11808/0900766b80f96399-11808172.pdf?src-supplier=Rs; ComponentLink1Description: https://datasheet.ciiva.com/11808/0900766b80f96399-11808172.pdf?src-supplier=Rs; ComponentLink2URL: https://datasheet.ciiva.com/5684/443971-5684699.pdf?src-supplier=Farnell; ComponentLink2Description: https://datasheet.ciiva.com/5684/443971-5684699.pdf?src-supplier=Farnell; ComponentLink3URL: https://datasheet.ciiva.com/7983/443971-7983627.pdf?src-supplier=Element14; ComponentLink3Description: https://datasheet.ciiva.com/7983/443971-7983627.pdf?src-supplier=Element14; ComponentLink4URL: https://datasheet.ciiva.com/22643/1868787-22643388.pdf?src-supplier=Element14; ComponentLink4Description: https://datasheet.ciiva.com/22643/1868787-22643388.pdf?src-supplier=Element14; ComponentLink5URL: https://datasheet.ciiva.com/46382/443971-46382072.pdf?src-supplier=Element14; ComponentLink5Description: https://datasheet.ciiva.com/46382/443971-46382072.pdf?src-supplier=Element14; ComponentLink6URL: https://datasheet.ciiva.com/29721/pyu-r-int-thick-7-29721178.pdf?src-supplier=Digi-Key; ComponentLink6Description: https://datasheet.ciiva.com/29721/pyu-r-int-thick-7-29721178.pdf?src-supplier=Digi-Key; ComponentLink7URL: https://datasheet.ciiva.com/29721/pyu-rc0603-51-rohs-l-4-29721179.pdf?src-supplier=Digi-Key; ComponentLink7Description: https://datasheet.ciiva.com/29721/pyu-rc0603-51-rohs-l-4-29721179.pdf?src-supplier=Digi-Key; ComponentLink8URL: https://datasheet.ciiva.com/5558/rc0603-272842-5558341.pdf?src-supplier=Mouser; ComponentLink8Description: https://datasheet.ciiva.com/5558/rc0603-272842-5558341.pdf?src-supplier=Mouser; Supplier Part Number 1: 603-RC0603FR-070RL; _Checked_SCH: HoP; _Creator: HoP; _SYM_REF: RES_0R_100mW_1%_0603
R?#5 R?#6 = Yageo_RC0603FR-070RL: MFG: Yageo; Power Rating: 100mW; Voltage Rating (DC): 50V; Temperature Coefficient: 200ppm/°C; Resistance Tolerance: 1%; _Checked_PCB: HoP; _Value: 0; Supplier 1: Mouser; MFG PN: RC0603FR-070RL; RoHS: Yes; Category: Chip SMD Resistors; Stock 1: 3348927; Pricing 1: 1=0.1, 10=0.01, 50=0.01, 100=0.005, 1000=0.004, 10000=0.003 (USD); Number of Pins: 2; Contact Plating: Tin,Matte; Case Code (Metric): 1608; Case Code (Imperial): 0603; Min Operating Temperature: -55°C; Max Operating Temperature: 155°C; Packaging: Tape and Reel; Resistor Type: Thick Film; Package Quantity: 5000; Voltage Rating: 50V; Number of Terminations: 2; Termination: SMD/SMT; Max Power Dissipation: 100mW; Features: Moisture Resistant; Series: RC; Construction: Rectangular; Technology: THICK FILM; Length: 1.6mm; Width: 0.8mm; Height: 0.45mm; Depth: 0.8mm; Reach SVHC Compliant: No; Lead Free: Lead Free; RoHS Compliant: Yes; Military Standard: Not; ComponentLink1URL: https://datasheet.ciiva.com/11808/0900766b80f96399-11808172.pdf?src-supplier=Rs; ComponentLink1Description: https://datasheet.ciiva.com/11808/0900766b80f96399-11808172.pdf?src-supplier=Rs; ComponentLink2URL: https://datasheet.ciiva.com/5684/443971-5684699.pdf?src-supplier=Farnell; ComponentLink2Description: https://datasheet.ciiva.com/5684/443971-5684699.pdf?src-supplier=Farnell; ComponentLink3URL: https://datasheet.ciiva.com/7983/443971-7983627.pdf?src-supplier=Element14; ComponentLink3Description: https://datasheet.ciiva.com/7983/443971-7983627.pdf?src-supplier=Element14; ComponentLink4URL: https://datasheet.ciiva.com/22643/1868787-22643388.pdf?src-supplier=Element14; ComponentLink4Description: https://datasheet.ciiva.com/22643/1868787-22643388.pdf?src-supplier=Element14; ComponentLink5URL: https://datasheet.ciiva.com/46382/443971-46382072.pdf?src-supplier=Element14; ComponentLink5Description: https://datasheet.ciiva.com/46382/443971-46382072.pdf?src-supplier=Element14; ComponentLink6URL: https://datasheet.ciiva.com/29721/pyu-r-int-thick-7-29721178.pdf?src-supplier=Digi-Key; ComponentLink6Description: https://datasheet.ciiva.com/29721/pyu-r-int-thick-7-29721178.pdf?src-supplier=Digi-Key; ComponentLink7URL: https://datasheet.ciiva.com/29721/pyu-rc0603-51-rohs-l-4-29721179.pdf?src-supplier=Digi-Key; ComponentLink7Description: https://datasheet.ciiva.com/29721/pyu-rc0603-51-rohs-l-4-29721179.pdf?src-supplier=Digi-Key; ComponentLink8URL: https://datasheet.ciiva.com/5558/rc0603-272842-5558341.pdf?src-supplier=Mouser; ComponentLink8Description: https://datasheet.ciiva.com/5558/rc0603-272842-5558341.pdf?src-supplier=Mouser; Supplier Part Number 1: 603-RC0603FR-070RL; _Checked_SCH: HoP; _Creator: HoP; _SYM_REF: RES_0R_100mW_1%_0603; Case/Package: 0603; Tolerance: 1%
SW?#1 = CK_PTS526SK15SMTR2LFS: MFG: ITT C&K; _Checked_PCB: HoP; Supplier 1: Mouser; RoHS: No; Category: Uncategorized; Stock 1: 68360; Pricing 1: 1=0.13, 10=0.128, 50=0.128, 100=0.11, 1000=0.079, 10000=0.067 (USD); Supplier Part Number 1: 611-PTS526SK15SMR2L; _Checked_SCH: HoP; _Creator: HoP; _SYM_REF: SW_Tactile_1_SPST-N.O._12_500m_SMD
U?#2 = Arduino_Uno-Frame-01: _Creator: HoP; _Checked_SCH: HoP; _Checked_PCB: *; _SYM_REF: ARDUINO_UNO-FRAME-01; MFG: *; MFG PN: *; Value: *